# EAGLE design DogGone (EAGLE 7.2.0)
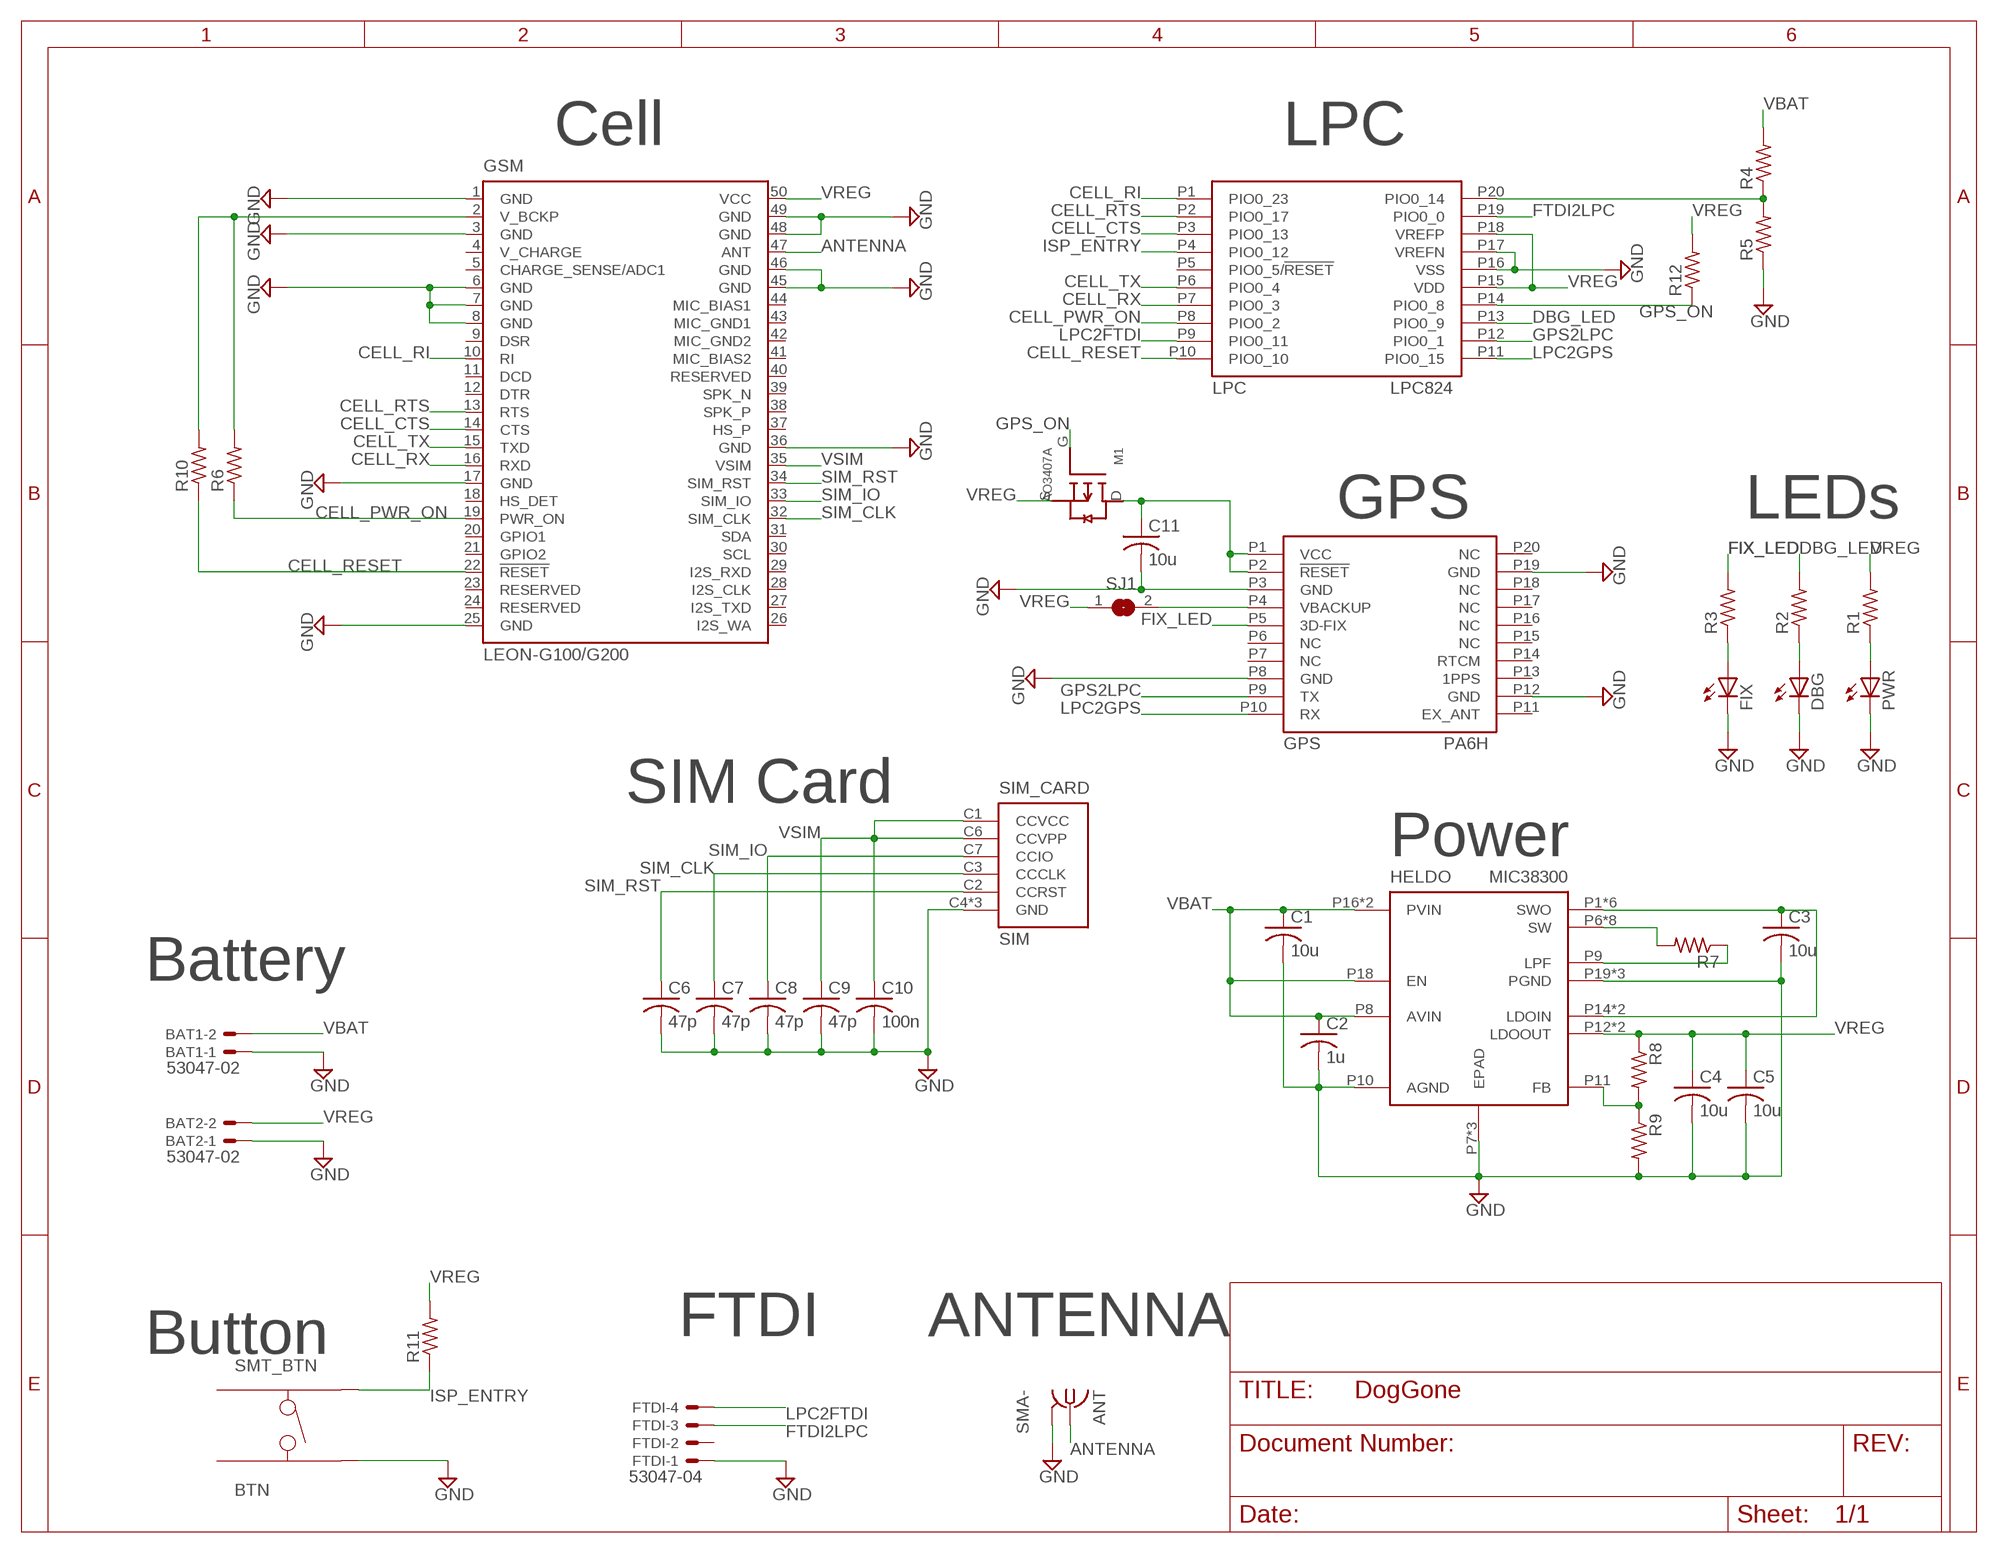
[diagram p0: schematic, sheet 1]

## Parts
ANT  SMA-  [J502-ND-142-0701-801/806]
BAT1  53047-02  [53047-02]
BAT2  53047-02  [53047-02]
BTN  SMT_BTN  [SMT_BUTTON]
C1  10u  C0603  [0603]
C2  1u  C0603  [0603]
C3  10u  C0603  [0603]
C4  10u  C0603  [0603]
C5  10u  C0603  [0603]
C6  47p  C0603  [0603]
C7  47p  C0603  [0603]
C8  47p  C0603  [0603]
C9  47p  C0603  [0603]
C10  100n  C0603  [0603]
C11  10u  C0603  [0603]
DBG  LEDCHIPLED_0603  [CHIPLED_0603]
FIX  LEDCHIPLED_0603  [CHIPLED_0603]
FTDI  53047-04  [53047-04]
GPS  PA6H  [DFN20]
GSM  LEON-G100/G200  [LEON-G100/G200]
HELDO  MIC38300  MIC38300_HELDO  [MLF]
LPC  LPC824  LPC824M201JDH20  [TSSOP20]
M1  AO3407A  [SOT23]
PWR  LEDCHIPLED_0603  [CHIPLED_0603]
R1  R0603  [R0603]
R2  R0603  [R0603]
R3  R0603  [R0603]
R4  R0603  [R0603]
R5  R0603  [R0603]
R6  R0603  [R0603]
R7  R0603  [R0603]
R8  R0603  [R0603]
R9  R0603  [R0603]
R10  R0603  [R0603]
R11  R0603  [R0603]
R12  R0603  [R0603]
SIM  SIM_CARD  [SIM8050]
SJ1  SJ  [SJ]

## Nets
ADC_IN: LPC.P20(PIO0_14) R4.1 R5.2
ANTENNA [antenna]: ANT.1 GSM.47(ANT)
CELL_CTS: GSM.14(CTS) LPC.P3(PIO0_13)
CELL_PWR_ON: GSM.19(PWR_ON) LPC.P8(PIO0_2) R6.1
CELL_RESET: GSM.22(!RESET) LPC.P10(PIO0_10) R10.1
CELL_RI: GSM.10(RI) LPC.P1(PIO0_23)
CELL_RTS: GSM.13(RTS) LPC.P2(PIO0_17)
CELL_RX: GSM.16(RXD) LPC.P7(PIO0_3)
CELL_TX: GSM.15(TXD) LPC.P6(PIO0_4)
DBG_LED: LPC.P13(PIO0_9) R2.2
FB: HELDO.P11(FB) R8.2 R9.1
FIX_LED: GPS.P5(3D-FIX) R3.2
FTDI2LPC: FTDI.3 LPC.P19(PIO0_0)
GND: ANT.G@1(GND) ANT.G@2(GND) ANT.G@3(GND) ANT.G@4(GND) BAT1.1 BAT2.1 BTN.P4 C1.2 C2.2 C3.2 C4.2 C5.2 C6.2 C7.2 C8.2 C9.2 C10.2 C11.2 DBG.C FIX.C FTDI.1 GPS.P3(GND) GPS.P8(GND) GPS.P12(GND) GPS.P19(GND) GSM.1(GND) GSM.3(GND) GSM.6(GND) GSM.7(GND) GSM.8(GND) GSM.17(GND) GSM.25(GND) GSM.36(GND) GSM.45(GND) GSM.46(GND) GSM.48(GND) GSM.49(GND) HELDO.P7(EPAD) HELDO.P8-21(EPAD) HELDO.P10(AGND) HELDO.P19(PGND) HELDO.P20(PGND) HELDO.P21(PGND) HELDO.P22(EPAD) LPC.P16(VSS) LPC.P17(VREFN) PWR.C R5.1 R9.2 SIM.C4(GND) SIM.C5(GND) SIM.C8(GND)
GPS2LPC: GPS.P9(TX) LPC.P12(PIO0_1)
GPS_ON: LPC.P14(PIO0_8) M1.G R12.1
ISP_ENTRY: BTN.P2 LPC.P4(PIO0_12) R11.1
LPC2FTDI: FTDI.4 LPC.P9(PIO0_11)
LPC2GPS: GPS.P10(RX) LPC.P11(PIO0_15)
LPF: HELDO.P9(LPF) R7.1
N$1: PWR.A R1.1
N$2: GPS.P4(VBACKUP) SJ1.2
N$3: C11.1 GPS.P1(VCC) GPS.P2(!RESET) M1.D
N$4: FIX.A R3.1
N$7: DBG.A R2.1
SIM_CLK: C7.1 GSM.32(SIM_CLK) SIM.C3(CCCLK)
SIM_IO: C8.1 GSM.33(SIM_IO) SIM.C7(CCIO)
SIM_RST: C6.1 GSM.34(SIM_RST) SIM.C2(CCRST)
SW: HELDO.P6(SW) HELDO.P23(SW) HELDO.P23-28(SW) HELDO.P24(SW) HELDO.P25(SW) HELDO.P26(SW) HELDO.P27(SW) HELDO.P28(SW) R7.2
SWO: C3.1 HELDO.P1(SWO) HELDO.P1-5(SWO) HELDO.P2(SWO) HELDO.P3(SWO) HELDO.P4(SWO) HELDO.P5(SWO) HELDO.P14(LDOIN) HELDO.P15(LDOIN)
V_BCKP: GSM.2(V_BCKP) R6.2 R10.2
VBAT: BAT1.2 C1.1 C2.1 HELDO.P8(AVIN) HELDO.P16(PVIN) HELDO.P17(PVIN) HELDO.P18(EN) R4.2
VREG: BAT2.2 C4.1 C5.1 GSM.50(VCC) HELDO.P12(LDOOUT) HELDO.P13(LDOOUT) LPC.P15(VDD) LPC.P18(VREFP) M1.S R1.2 R8.1 R11.2 R12.2 SJ1.1
VSIM: C9.1 C10.1 GSM.35(VSIM) SIM.C1(CCVCC) SIM.C6(CCVPP)
Unconnected: BTN.P1 BTN.P3 FTDI.2 GPS.P6(NC) GPS.P7(NC) GPS.P11(EX_ANT) GPS.P13(1PPS) GPS.P14(RTCM) GPS.P15(NC) GPS.P16(NC) GPS.P17(NC) GPS.P18(NC) GPS.P20(NC) GSM.4(V_CHARGE) GSM.5(CHARGE_SENSE/ADC1) GSM.9(DSR) GSM.11(DCD) GSM.12(DTR) GSM.18(HS_DET) GSM.20(GPIO1) GSM.21(GPIO2) GSM.23(RESERVED) GSM.24(RESERVED) GSM.26(I2S_WA) GSM.27(I2S_TXD) GSM.28(I2S_CLK) GSM.29(I2S_RXD) GSM.30(SCL) GSM.31(SDA) GSM.37(HS_P) GSM.38(SPK_P) GSM.39(SPK_N) GSM.40(RESERVED) GSM.41(MIC_BIAS2) GSM.42(MIC_GND2) GSM.43(MIC_GND1) GSM.44(MIC_BIAS1) LPC.P5(PIO0_5/!RESET)

## Notes on the sheet
- Cell | LPC
- GPS | LEDs
- SIM Card
- Power
- Battery
- Button | FTDI | ANTENNA

## Library data of the parts
ANT = MyLib:SMA-
BAT1 BAT2 = con-molex:53?-02: CONNECTOR wire to board 1.25 mm (.049 inch) pitch header; MF: MOLEX; MPN: 53047-0210; OC_FARNELL: 9733051; OC_NEWARK: 57H4701
BTN = MyLib:SMT_BTN
C1-C11 = MyLib:C0603
DBG FIX PWR = led:LED: LED OSRAM: - CHIPLED LG R971, LG N971, LY N971, LG Q971, LY Q971, LO R971, LY R971 LH N974, LH R974 LS Q976, LO Q976, LY Q976 LO Q996 - Hyper CHIPLED LW Q18S LB Q993, LB Q99A, LB R99A - SideLED LS A670, LO A670, LY A670, LG A670, LP A670 LB A673, LV A673, LT A673, LW A673 LH A674 LY A675 LS A676, LA A676, LO A676, LY A676, LW A676 LS A679, LY A679, LG A679 - Hyper Micro SIDELED® LS Y876, LA Y876, LO Y876, LY Y876 LT Y87S - SmartLED LW L88C, LW L88S LB L89C, LB L89S, LG L890 LS L89K, LO L89K, LY L89K LS L896, LA L896, LO L896, LY L896 - TOPLED LS T670, LO T670, LY T670, LG T670, LP T670 LSG T670, LSP T670, LSY T670, LOP T670, LYG T670 LG T671, LOG T671, LSG T671 LB T673, LV T673, LT T673, LW T673 LH T674 LS T676, LA T676, LO T676, LY T676, LB T676, LH T676, LSB T676, LW T676 LB T67C, LV T67C, LT T67C, LS T67K, LO T67K, LY T67K, LW E67C LS E67B, LA E67B, LO E67B, LY E67B, LB E67C, LV E67C, LT E67C LW T67C LS T679, LY T679, LG T679 LS T770, LO T770, LY T770, LG T770, LP T770 LB T773, LV T773, LT T773, LW T773 LH T774 LS E675, LA E675, LY E675, LS T675 LS T776, LA T776, LO T776, LY T776, LB T776 LHGB T686 LT T68C, LB T68C - Hyper Mini TOPLED® LB M676 - Mini TOPLED Santana® LG M470 LS M47K, LO M47K, LY M47K Source: http://www.osram.convergy.de LUXEON: - LUMILED® LXK2-PW12-R00, LXK2-PW12-S00, LXK2-PW14-U00, LXK2-PW14-V00 LXK2-PM12-R00, LXK2-PM12-S00, LXK2-PM14-U00 LXK2-PE12-Q00, LXK2-PE12-R00, LXK2-PE12-S00, LXK2-PE14-T00, LXK2-PE14-U00 LXK2-PB12-K00, LXK2-PB12-L00, LXK2-PB12-M00, LXK2-PB14-N00, LXK2-PB14-P00, LXK2-PB14-Q00 LXK2-PR12-L00, LXK2-PR12-M00, LXK2-PR14-Q00, LXK2-PR14-R00 LXK2-PD12-Q00, LXK2-PD12-R00, LXK2-PD12-S00 LXK2-PH12-R00, LXK2-PH12-S00 LXK2-PL12-P00, LXK2-PL12-Q00, LXK2-PL12-R00 Source: www.luxeon.com KINGBRIGHT: KA-3528ASYC Source: www.kingbright.com
FTDI = con-molex:53?-04: CONNECTOR wire to board 1.25 mm (.049 inch) pitch header; MF: WALDOM/MOLEX; MPN: 53047-0410; OC_FARNELL: 9733060; OC_NEWARK: 38C9900
GPS = MyLib:PA6H
GSM = u-blox:LEON-G100/G200: LEON-G100/G200 Quad Band GSM/GPRS Voice and Data Modules Source: http://www.u-blox.com; OC_FARNELL: unknown; OC_NEWARK: unknown
HELDO = MyLib:MIC38300_HELDO: Micrel MIC38300 High Efficiency Low Dropout Regulator
LPC = MyLib:LPC824M201JDH20: LPC824 microcontroller in TSSOP20 package made by NXP
M1 = MyLib:AO3407A
R1-R12 = MyLib:R0603: SMT 0603 resistor
SIM = MyLib:SIM_CARD: Nano SIM card
SJ1 = jumper:SJ: SMD solder JUMPER

## Net classes
1 antenna: width 0.8 mm, clearance 0.152 mm
2 cell_vcc: width 0.8 mm

## Board
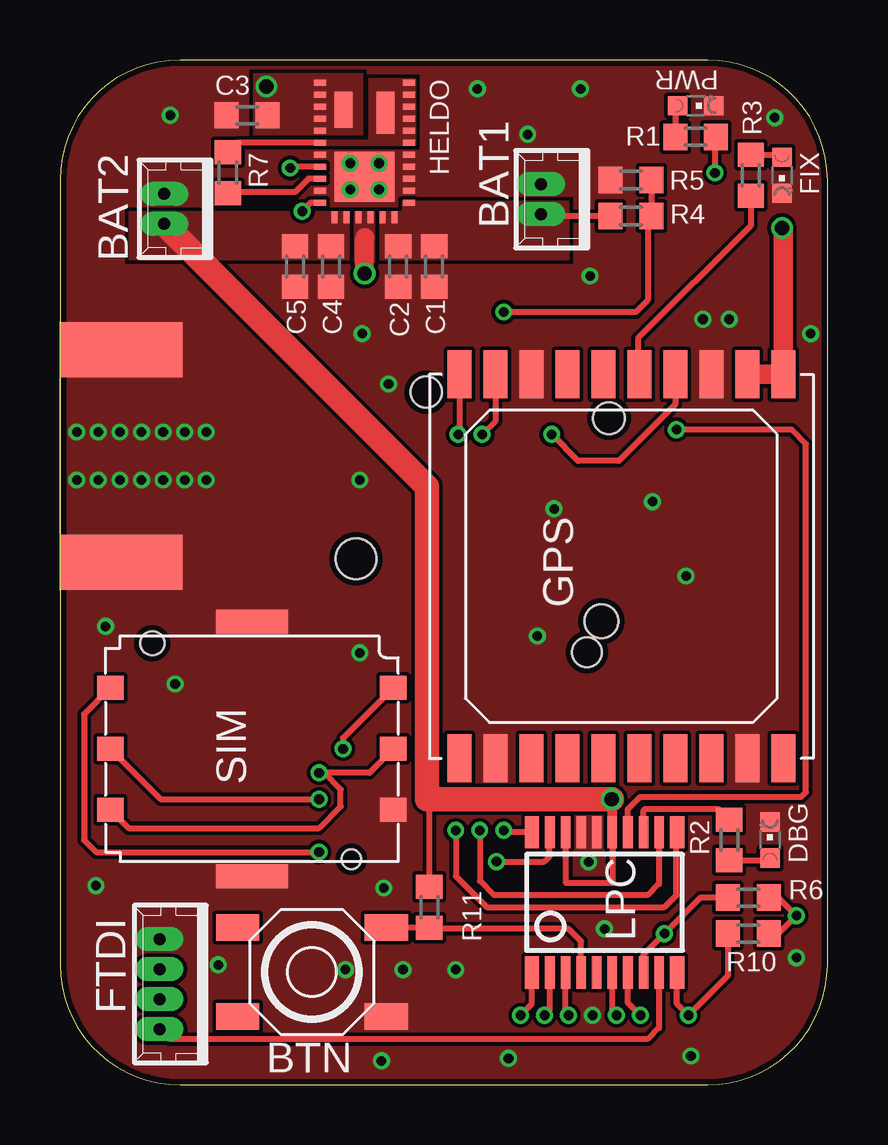
[diagram p1: board, top side]
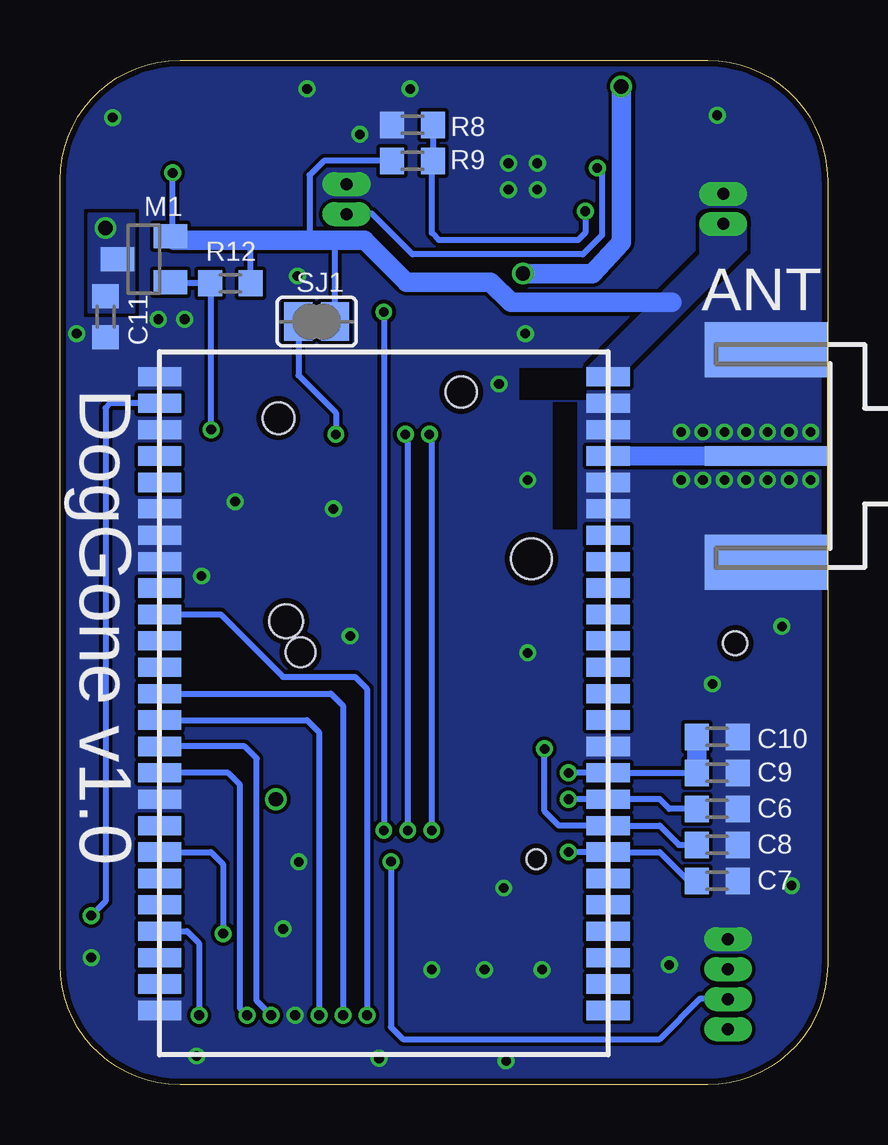
[diagram p2: board, bottom side, seen from below]

Size 32 x 42.7 mm. Coordinates in mm from the lower left corner, seen from the top.
Outline: 0,37.7 0,5 arc90 5,0 27,0 arc90 32,5 32,37.7 arc90 27,42.7 5,42.7 arc90 0,37.7
Copper layers (1*16): Top 0.035mm / dielectric 1.5mm / Bottom 0.035mm
Design rules "SeeedStudio_2layer_DRU_no_angle_20140221": minimum track width 6mil, minimum drill 12mil, track to track 6mil, track to pad 6mil, pad to pad 6mil, via to via 6mil, smd to smd 0mil, copper to edge 10mil, drill to drill 10mil, minimum pad ring 10mil, minimum via ring 6mil, stop-mask expansion 2mil, vias tented up to drill 100mil, thermal gap 10mil

### Footprints (pad centres in the part's own frame; a part is rotated, then mirrored left to right if it is on the bottom)
J502-ND-142-0701-801/806 = smd 5.08 x 0.8: 1 2.565,0 | smd 5.08 x 2.286: G@1 2.565,4.42; G@2 2.565,-4.42 | smd 5.08 x 2.286 bottom: G@3 2.565,4.42; G@4 2.565,-4.42
53047-02 = drill 0.5 pad 0.698 long: 1 0.625,0.45; 2 -0.625,0.45
SMT_BUTTON = smd 1.8 x 1.1: P1 -3.1,1.85; P2 3.1,1.85; P3 -3.1,-1.85; P4 3.1,-1.85
0603 = smd 1 x 1.1: 1 -0.85,0; 2 0.85,0
CHIPLED_0603 = smd 0.8 x 0.8: A 0,-0.75; C 0,0.75
53047-04 = drill 0.5 pad 0.698 long: 1 1.875,0.45; 2 0.625,0.45; 3 -0.625,0.45; 4 -1.875,0.45
DFN20 = smd 2 x 1: P1 -8,6.75; P2 -8,5.25; P3 -8,3.75; P4 -8,2.25; P5 -8,0.75; P6 -8,-0.75; P7 -8,-2.25; P8 -8,-3.75; P9 -8,-5.25; P10 -8,-6.75; P11 8,-6.75; P12 8,-5.25; P13 8,-3.75; P14 8,-2.25; P15 8,-0.75; P16 8,0.75; P17 8,2.25; P18 8,3.75; P19 8,5.25; P20 8,6.75
LEON-G100/G200 = smd 1.8 x 0.8: 1 -9.35,13.6; 2 -9.35,12.5; 3 -9.35,11.4; 4 -9.35,10.3; 5 -9.35,9.2; 6 -9.35,8.1; 7 -9.35,7; 8 -9.35,5.9; 9 -9.35,4.8; 10 -9.35,3.7; 11 -9.35,2.6; 12 -9.35,1.5; 13 -9.35,0.4; 14 -9.35,-0.7; 15 -9.35,-1.8; 16 -9.35,-2.9; 17 -9.35,-4; 18 -9.35,-5.1; 19 -9.35,-6.2; 20 -9.35,-7.3; 21 -9.35,-8.4; 22 -9.35,-9.5; 23 -9.35,-10.6; 24 -9.35,-11.7; 25 -9.35,-12.8; 26 9.35,-12.8; 27 9.35,-11.7; 28 9.35,-10.6; 29 9.35,-9.5; 30 9.35,-8.4; 31 9.35,-7.3; 32 9.35,-6.2; 33 9.35,-5.1; 34 9.35,-4; 35 9.35,-2.9; 36 9.35,-1.8; 37 9.35,-0.7; 38 9.35,0.4; 39 9.35,1.5; 40 9.35,2.6; 41 9.35,3.7; 42 9.35,4.8; 43 9.35,5.9; 44 9.35,7; 45 9.35,8.1; 46 9.35,9.2; 47 9.35,10.3; 48 9.35,11.4; 49 9.35,12.5; 50 9.35,13.6 | hole 1.31: -4.39,11.88 | hole 1.29: 3.23,12.96 | hole 1.7: 6.16,6.02 | hole 1.4: -4.07,3.42 | hole 1.24: -3.47,2.12
MLF = smd 0.25 x 0.5: P1 -2.755,-1.85; P2 -2.255,-1.85; P3 -1.755,-1.85; P4 -1.255,-1.85; P5 -0.755,-1.85; P6 -0.255,-1.85; P7 0.245,-1.85; P8 0.745,-1.85; P9 1.245,-1.85; P10 1.745,-1.85; P11 2.245,-1.85; P18 2.245,1.85; P19 1.745,1.85; P20 1.245,1.85; P21 0.745,1.85; P22 0.245,1.85; P23 -0.255,1.85; P24 -0.755,1.85; P25 -1.255,1.85; P26 -1.755,1.85; P27 -2.255,1.85; P28 -2.755,1.85 | smd 1.5 x 0.75: P1-5 -1.63,-0.875 | smd 2.1 x 2.5: P8-21 1.165,0 | smd 0.5 x 0.25: P12 2.845,-1.25; P13 2.845,-0.75; P14 2.845,-0.25; P15 2.845,0.25; P16 2.845,0.75; P17 2.845,1.25 | smd 1.75 x 0.75: P23-28 -1.505,0.875
TSSOP20 = smd 1.35 x 0.6: P1 -2.925,3.025; P10 -2.925,-3.025; P11 2.925,-3.025; P20 2.925,3.025 | smd 1.35 x 0.4: P2 -2.925,2.275; P3 -2.925,1.625; P4 -2.925,0.975; P5 -2.925,0.325; P6 -2.925,-0.325; P7 -2.925,-0.975; P8 -2.925,-1.625; P9 -2.925,-2.275; P12 2.925,-2.275; P13 2.925,-1.625; P14 2.925,-0.975; P15 2.925,-0.325; P16 2.925,0.325; P17 2.925,0.975; P18 2.925,1.625; P19 2.925,2.275
SOT23 = smd 1 x 1.4: D 0,1.1; G -0.95,-1.1; S 0.95,-1.1
R0603 = smd 1 x 1.1: 1 -0.85,0; 2 0.85,0
SIM8050 = smd 1 x 1.1: C1 2.54,-5.9; C2 0,-5.9; C3 -2.54,-5.9; C5 2.54,5.9; C6 0,5.9; C7 -2.54,5.9 | smd 1 x 3: C4 5.3,0; C8 -5.3,0 | hole 0.8: 4.6,4.15 | hole 1: -4.4,-4.15
SJ = smd 1.168 x 1.6: 1 -0.762,0; 2 0.762,0

### Placement (x,y rotation side)
ANT  0,26.2 180 bottom
BAT1  20.5,36.9 90 top
BAT2  4.8,36.5 90 top
BTN  10.5,4.7 0 top
C1  15.6,34.1 270 top
C2  14.1,34.1 270 top
C3  7.8,40.4 180 top
C4  11.3,34.1 270 top
C5  9.8,34.1 270 top
C6  4.6,11.5 0 bottom
C7  4.6,8.5 0 bottom
C8  4.6,10 0 bottom
C9  4.6,13 0 bottom
C10  4.6,14.5 0 bottom
C11  30.1,32 270 bottom
DBG  29.6,10.2 0 top
DRILEGEND  [DRILEGEND]  -9.53,-3.86 0 top  (outside the outline)
FIX  30.1,37.9 180 top
FTDI  4.6,4.2 90 top
GPS  23.4,21.6 270 top
GSM  18.5,15.9 0 bottom
HELDO  12.7,39 270 top
LPC  22.7,7.6 90 top
M1  28.5,34.4 90 bottom
PWR  26.5,40.8 270 top
R1  26.5,39.5 0 top
R2  27.9,10.2 90 top
R3  28.8,37.9 270 top
R4  23.8,36.2 180 top
R5  23.8,37.7 0 top
R6  28.7,7.8 0 top
R7  7,38 90 top
R8  17.3,38.5 0 bottom
R9  17.3,40 180 bottom
R10  28.7,6.3 0 top
R11  15.4,7.4 90 top
R12  24.9,33.4 0 bottom
SIM  8,14 270 top
SJ1  21.3,31.8 180 bottom

### Tracks (layer width: path | path; a pad name or v marks a point on that pad's centre or on a via)
ADC_IN  (via drill 0.4)
  Top 0.254: LPC.P20 18.57,10.53 v18.5,10.6 | R5.2 R4.1 24.5,36.05 24.5,32.7 24,32.2 v18.5,32.2
  Bottom 0.254: v18.5,32.2 v18.5,10.6
ANTENNA
  Bottom 0.8: ANT.1 GSM.47
CELL_CTS  (via drill 0.4)
  Top 0.254: v21.2,2.9 21.07,3.02 LPC.P3
  Bottom 0.254: GSM.14 21.7,15.2 21.2,14.7 v21.2,2.9
CELL_PWR_ON  (via drill 0.4)
  Top 0.254: LPC.P8 24.32,5.42 v25.2,6.3 26.7,7.8 R6.1
  Bottom 0.254: GSM.19 25.7,9.7 25.2,9.2 v25.2,6.3
CELL_RESET  (via drill 0.4)
  Top 0.254: LPC.P10 25.73,3.38 v26.2,2.9 27.85,4.55 R10.1
  Bottom 0.254: GSM.22 26.7,6.4 26.2,5.9 v26.2,2.9
CELL_RI  (via drill 0.4)
  Top 0.254: v19.2,2.9 19.68,3.38 LPC.P1
  Bottom 0.254: GSM.10 25.3,19.6 22.7,17 19.7,17 19.2,16.5 v19.2,2.9
CELL_RTS  (via drill 0.4)
  Top 0.254: v20.2,2.9 20.43,3.12 LPC.P2
  Bottom 0.254: GSM.13 20.7,16.3 20.2,15.8 v20.2,2.9
CELL_RX  (via drill 0.4)
  Top 0.254: v24.2,2.9 23.68,3.42 LPC.P7
  Bottom 0.254: v24.2,2.9 24.5,3.2 24.5,12.5 25,13 GSM.16
CELL_TX  (via drill 0.4)
  Top 0.254: v23.2,2.9 23.02,3.08 LPC.P6
  Bottom 0.254: v23.2,2.9 23.8,3.5 23.8,13.6 24.3,14.1 GSM.15
DBG_LED
  Top 0.254: LPC.P13 24.32,11.43 24.4,11.5 27.45,11.5 R2.2
FB  (via drill 0.4)
  Top 0.254: HELDO.P11 10.46,36.76 v10.1,36.4
  Bottom 0.254: R9.1 R8.2 16.5,38.45 16.5,35.5 16.2,35.2 10.4,35.2 10.1,35.5 v10.1,36.4
FIX_LED
  Top 0.254: R3.2 28.8,35.8 24.1,31.1 24.1,29.65 GPS.P5
FTDI2LPC  (via drill 0.4)
  Top 0.254: v18.2,9.3 20.2,9.3 20.4,9.5 20.4,10.5 LPC.P19
  Bottom 0.254: v18.2,9.3 18.2,2.4 17.7,1.9 7,1.9 5.3,3.6 4.17,3.6 FTDI.3
GND  (via drill 0.4)
  other vias: 22.04,9.29 12.1,38.4 13.3,38.4 12.1,37.3 13.3,37.3 17.4,41.5 21.7,41.5 29.8,40.3 26.8,31.9 27.9,31.9 22.1,33.7 12.6,31.3 4.6,40.4 0.7,27.2 1.6,27.2 2.5,27.2 3.4,27.2 4.3,27.2 5.2,27.2 6.1,27.2 0.7,25.2 1.6,25.2 2.5,25.2 3.4,25.2 4.3,25.2 5.2,25.2 6.1,25.2 13.7,29.2 12.5,25.2 12.5,18 4.8,16.7 1.5,8.3 6.6,5 11.9,4.8 14.3,4.8 16.5,4.8 13.4,1 18.7,1.1 26.3,1.2 30.7,5.3 22.7,6.5 22.2,2.9 19.9,18.7 26.1,21.2 20.6,24 24.7,24.3 1.9,19.1 19.5,39.6 31.3,31.3 13.5,8.2
  pour Top (rank 5, no thermals): 21.5,11.2 22.6,11.2 22.6,8.9 22.5,8.8 21.6,8.8 21.5,8.9
  pour Top (rank 6, no thermals): 0,0 32,0 32,43 0,43
  pour Bottom (rank 6, no thermals): 0,0 32,0 32,43 0,43
  pour Top (rank 5, no thermals): 14.8,38.9 14.8,37.1 14,37.1 14,36.7 11.4,36.7 11.4,37.1 10.6,37.1 10.6,37.4 11.4,37.4 11.4,38.6 10.6,38.6 10.6,38.9
GPS2LPC  (via drill 0.4)
  Top 0.254: LPC.P12 24.98,8.38 24.5,7.9 18.1,7.9 17.5,8.5 v17.5,10.6 | GPS.P9 18.15,27.65 v17.6,27.1
  Bottom 0.254: v17.5,10.6 17.5,27 v17.6,27.1
GPS_ON  (via drill 0.4)
  Top 0.254: LPC.P14 23.68,11.47 24.2,12 30.9,12 31.1,12.2 31.1,26.7 30.5,27.3 v25.7,27.3
  Bottom 0.254: v25.7,27.3 25.7,33.35 R12.1 27.35,33.4 M1.G
ISP_ENTRY
  Top 0.254: BTN.P2 R11.1 15.45,6.5 21.2,6.5 21.73,5.97 LPC.P4
LPC2FTDI
  Top 0.254: LPC.P9 24.98,2.38 24.5,1.9 4.58,1.9 FTDI.4
LPC2GPS  (via drill 0.4)
  Top 0.254: v16.5,10.6 16.5,8.7 17.8,7.4 25.2,7.4 25.7,7.9 25.7,10.5 LPC.P11 | GPS.P10 16.65,27.15 v16.6,27.1
  Bottom 0.254: v16.5,10.6 16.5,27 v16.6,27.1
LPF
  Top 0.254: HELDO.P9 10.36,37.76 9.8,37.2 7.05,37.2 R7.1
N$1
  Top 0.254: PWR.A 25.65,40.7 R1.1
N$2  (via drill 0.4)
  Top 0.254: GPS.P4 25.65,28.35 23.3,26 21.6,26 v20.5,27.1
  Bottom 0.254: SJ1.2 22.06,29.56 20.5,28 v20.5,27.1
N$3  (via drill 0.6)
  Top 0.813: GPS.P2 GPS.P1 30.15,35.65 v30.1,35.7
  pour Bottom (rank 5, no thermals): 28.9,36.3 30.8,36.3 30.8,32.2 28.9,32.2
N$4
  Top 0.254: R3.1 30,38.75 FIX.A
N$7
  Top 0.254: R2.1 29.5,9.35 DBG.A
SIM_CLK  (via drill 0.4)
  Top 0.254: SIM.C3 1,15.44 1,10.2 1.5,9.7 v10.8,9.7
  Bottom 0.254: v10.8,9.7 GSM.32 7,9.7 5.8,8.5 C7.1
SIM_IO  (via drill 0.4)
  Top 0.254: SIM.C7 11.8,14.44 v11.8,14
  Bottom 0.254: v11.8,14 11.8,11.4 11.2,10.8 GSM.33 7,10.8 6.2,10 C8.1
SIM_RST  (via drill 0.4)
  Top 0.254: SIM.C2 4.2,11.9 v10.8,11.9
  Bottom 0.254: v10.8,11.9 GSM.34 7,11.9 6.6,11.5 C6.1
SW
  Top 0.254: HELDO.P6 7.41,39.26 R7.2
  pour Top (rank 5, no thermals): 12.9,41.9 12.9,39.33 10.6,39.33 10.6,39.17 14.8,39.17 14.8,41.9
SWO  (via drill 0.6)
  Top 0.8: v12.7,33.8 12.7,35.3
  Bottom 0.813: v8.6,41.6 8.6,35.1 9.8,33.8 v12.7,33.8
  pour Top (rank 5, no thermals): 13.1,36.36 13.1,34.3 12.3,34.3 12.3,36.36
  pour Top (rank 5, no thermals): 12.6,39.6 12.6,42.1 8.1,42.1 8.1,39.6
V_BCKP  (via drill 0.4)
  Top 0.254: R6.2 29.95,7.8 v30.7,7.05 29.95,6.3 R10.2
  Bottom 0.254: GSM.2 29.9,28.4 30.1,28.2 30.1,7.65 v30.7,7.05
VBAT  (via drill 0.4)
  Top 0.254: R4.2 20.12,36.2 BAT1.2 | HELDO.P8 9.65,38.26 v9.6,38.2
  Bottom 0.254: v9.6,38.2 9.4,38 9.4,35.4 10.2,34.6 17.3,34.6 19,36.3 20,36.3 20.02,36.27 BAT1.2
  pour Top (rank 5, no thermals): 13.37,36.36 14.3,36.36 14.3,36.8 21.2,36.8 21.2,34.4 13.37,34.4
VREG  (via drill 0.4, 0.6)
  Top 0.254: LPC.P15 23.02,8.4 21.1,8.4 21.1,10.53 LPC.P18 | R11.2 15.4,12.2 15.3,12.3 | R1.2 27.3,39.45 v27.3,38
  Top 0.406: LPC.P15 23.02,11.88 v23,11.9
  Top 1.016: v23,11.9 15.3,11.9 15.3,12.3 15.3,24.93 BAT2.2
  Bottom 0.254: SJ1.1 20.54,34.96 20.3,35.2 | R12.2 24.05,34.95 24.3,35.2 | 21.6,35.2 21.6,37.9 21,38.5 R8.1 | M1.S 27.3,35.45 v27.3,38
  Bottom 0.813: M1.S 27.25,35.2 24.3,35.2 21.6,35.2 20.3,35.2 19.3,35.2 17.55,33.45 14.05,33.45 13.2,32.6 6.5,32.6
  pour Top (rank 5, no thermals): 12.03,36.36 2.9,36.36 2.9,34.4 12.03,34.4
  pour Bottom (rank 5, no thermals): 8.3,29.2 8.3,29.9 3.4,34.8 3.4,35.9 arc-90 3.8,36.3 4.9,36.3 arc-90 5.3,35.9 5.3,34.6 10,29.9 10,29.2
VSIM  (via drill 0.4)
  Top 0.254: SIM.C1 2.86,10.7 10.8,10.7 11.7,11.6 11.7,12.3 11,13 v10.8,13 12.9,13 SIM.C6
  Bottom 0.254: v10.8,13 GSM.35 C9.1
  Bottom 0.813: C10.1 C9.1

### Text on the board
bPlace: DogGone v1.0
DrillLegend: LAYER-STACK
DrillLegend_01-16: 01-16
DrillLegend_01-20: 01-20